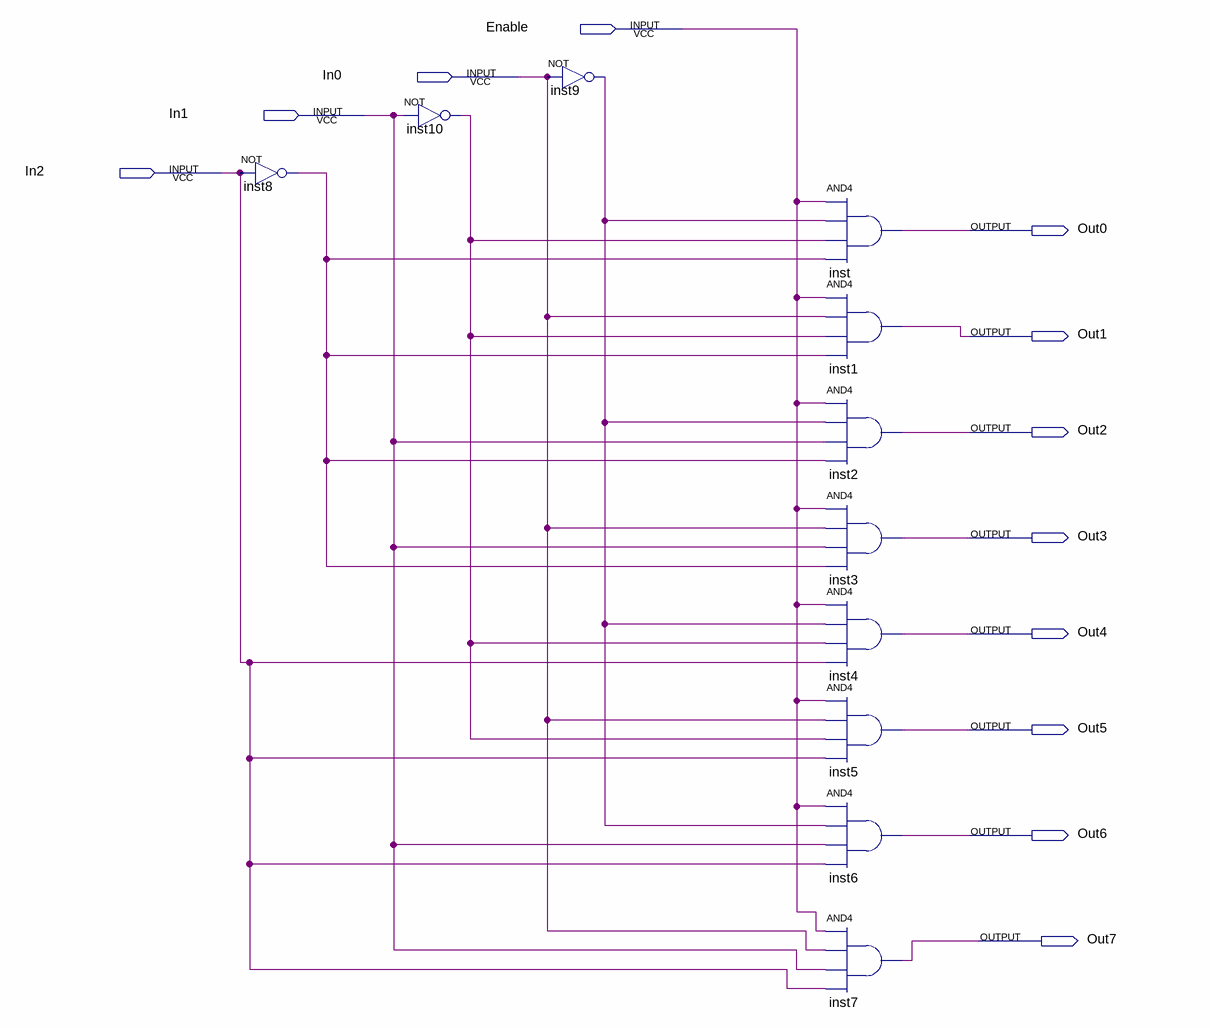
[diagram p0: schematic sheet]
// Quartus schematic DCD.bdf as structural Verilog: 11 symbols, 12 pins
module DCD (
  input  Enable,
  input  In0,
  input  In1,
  input  In2,
  output Out0,
  output Out1,
  output Out2,
  output Out3,
  output Out4,
  output Out5,
  output Out6,
  output Out7
);

  wire inst8_out, inst9_out, inst10_out;

  not inst8 (inst8_out, In2);
  not inst10 (inst10_out, In1);
  not inst9 (inst9_out, In0);
  and inst (Out0, Enable, inst9_out, inst10_out, inst8_out);
  and inst1 (Out1, Enable, In0, inst10_out, inst8_out);
  and inst2 (Out2, Enable, inst9_out, In1, inst8_out);
  and inst3 (Out3, Enable, In0, In1, inst8_out);
  and inst4 (Out4, Enable, inst9_out, inst10_out, In2);
  and inst5 (Out5, Enable, In0, inst10_out, In2);
  and inst6 (Out6, Enable, inst9_out, In1, In2);
  and inst7 (Out7, Enable, In0, In1, In2);
endmodule
